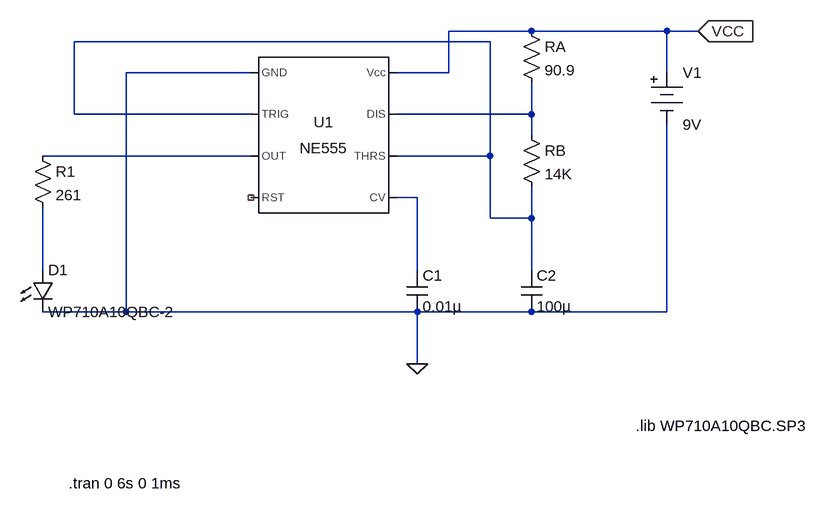
[diagram p0: schematic 555 timer.asc]
555 timer.asc, the LTspice schematic file:
Version 4
SHEET 1 1376 808
WIRE 960 96 832 96
WIRE 1168 96 960 96
WIRE 1216 96 1168 96
WIRE 896 112 256 112
WIRE 528 160 336 160
WIRE 832 160 832 96
WIRE 832 160 752 160
WIRE 1168 160 1168 96
WIRE 256 224 256 112
WIRE 528 224 256 224
WIRE 960 224 960 176
WIRE 960 224 752 224
WIRE 960 256 960 224
WIRE 528 288 208 288
WIRE 896 288 896 112
WIRE 896 288 752 288
WIRE 784 352 752 352
WIRE 896 384 896 288
WIRE 960 384 960 336
WIRE 960 384 896 384
WIRE 208 464 208 368
WIRE 784 464 784 352
WIRE 960 464 960 384
WIRE 336 528 336 160
WIRE 336 528 208 528
WIRE 784 528 336 528
WIRE 960 528 784 528
WIRE 1168 528 1168 240
WIRE 1168 528 960 528
WIRE 784 608 784 528
FLAG 1216 96 VCC
IOPIN 1216 96 In
FLAG 784 608 0
SYMBOL Misc/NE555 640 256 R0
SYMATTR InstName U1
SYMBOL Misc/battery 1168 144 R0
SYMATTR InstName V1
SYMATTR Value 9V
SYMBOL res 192 272 R0
SYMATTR InstName R1
SYMATTR Value 261
SYMBOL res 944 240 R0
SYMATTR InstName RB
SYMATTR Value 14K
SYMBOL res 944 80 R0
SYMATTR InstName RA
SYMATTR Value 90.9
SYMBOL LED 192 464 R0
SYMATTR InstName D1
SYMATTR Value WP710A10QBC-2
SYMBOL cap 768 464 R0
SYMATTR InstName C1
SYMATTR Value 0.01µ
SYMBOL cap 944 464 R0
SYMATTR InstName C2
SYMATTR Value 100µ
TEXT 1120 704 Left 2 !.lib WP710A10QBC.SP3
TEXT 248 792 Left 2 !.tran 0 6s 0 1ms

The netlist it stands for:
* 555 timer.asc
XU1 0 N001 N003 NC_01 N004 N001 N002 VCC NE555  ; pins GND TRIG OUT RST CV THRS DIS Vcc
V1 VCC 0 9V
R1 N003 N005 261
RB N002 N001 14K
RA VCC N002 90.9
D1 N005 0 WP710A10QBC-2
C1 N004 0 0.01µ
C2 N001 0 100µ
.model D D
.lib standard.dio
.lib WP710A10QBC.SP3
.tran 0 6s 0 1ms
.lib NE555.sub
.backanno
.end